# Altium schematic sheet Sheet_1_2022-05-04.schdoc
size 430 x 307 mm
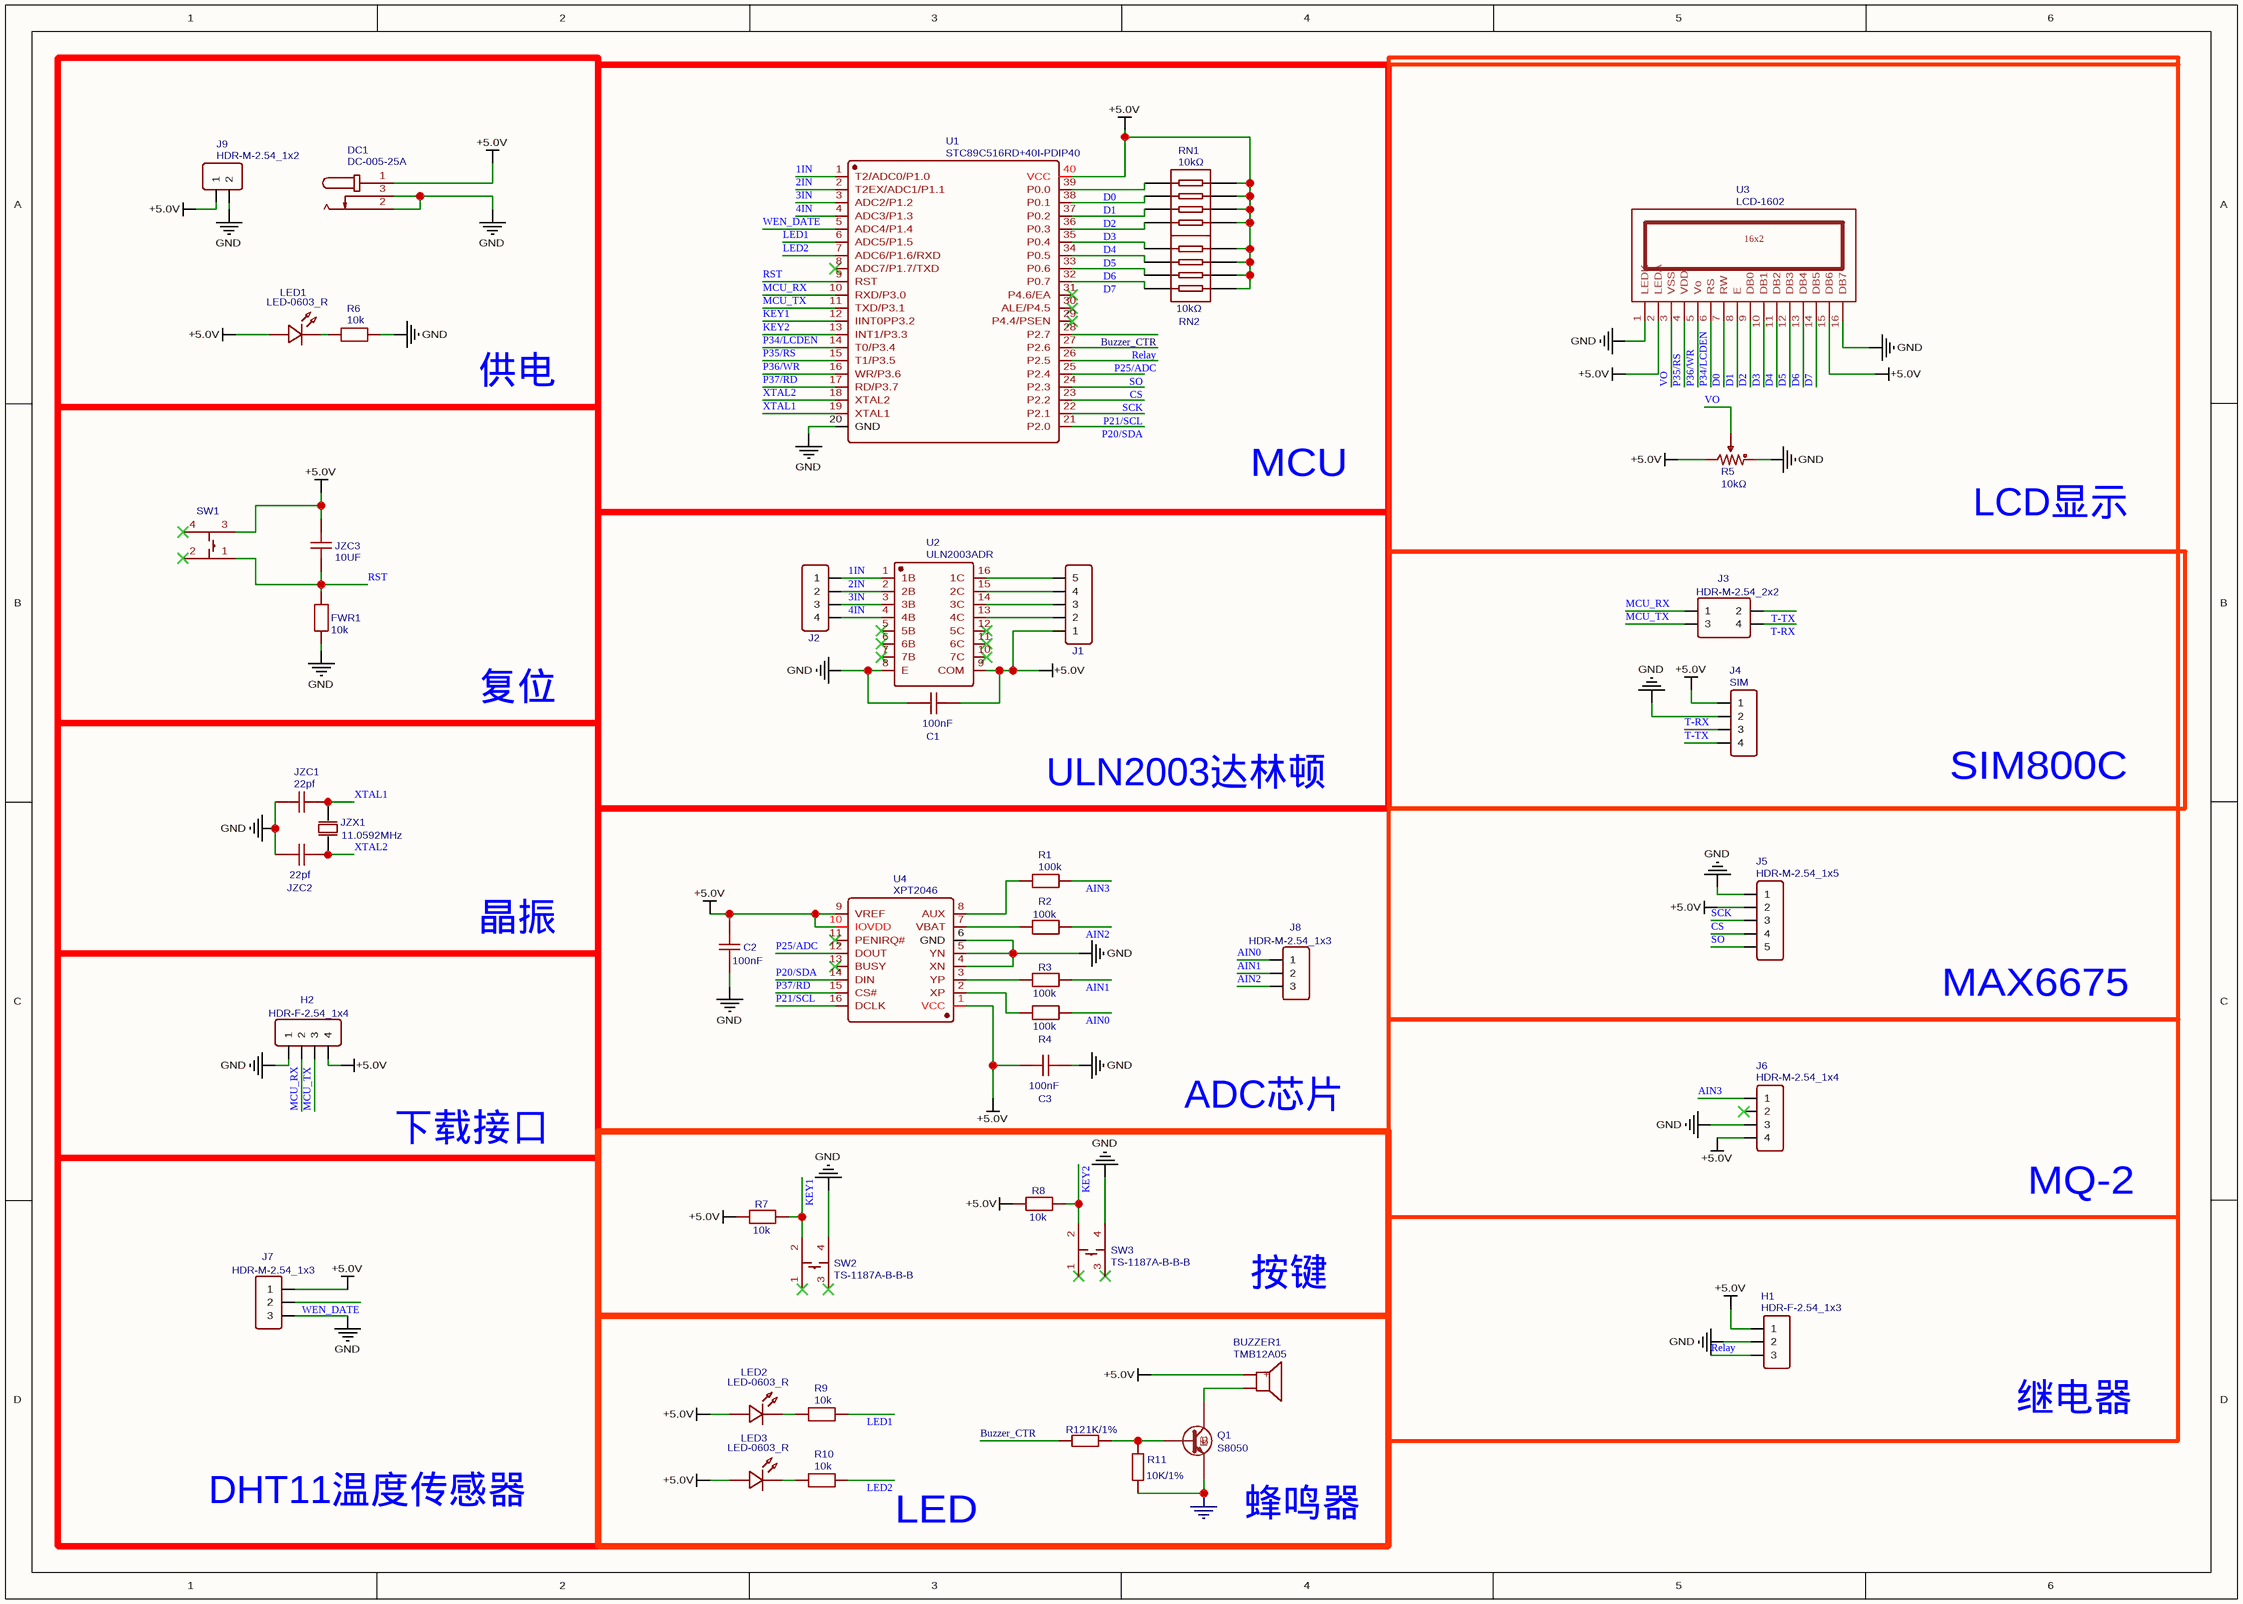
[diagram p0: Sheet_1_2022-05-04.schdoc]

## Parts
BUZZER1  TMB12A05  [BUZ-TH_BD12.0-P7.60-D0.6-FD]
C1  100nF  [C0603]
C2  100nF  [C0603]
C3  100nF  [C0603]
DC1  DC-005-25A  [DC-IN-TH_DC005]
FWR1  10k  [R0603]
H1  HDR-F-2.54_1x3  [HDR-F-2.54_1X3]
H2  HDR-F-2.54_1x4  [HDR-F-2.54_1X4]
J1  HDR-M-2.54_1x5  [HDR-M-2.54_1X5]  (value not drawn)
J2  HDR-M-2.54_1x4  [HDR-M-2.54_1X4]  (value not drawn)
J3  HDR-M-2.54_2x2  [HDR-M-2.54_2X2]
J4  SIM  [HDR-M-2.54_1X4]
J5  HDR-M-2.54_1x5  [HDR-M-2.54_1X5]
J6  HDR-M-2.54_1x4  [HDR-M-2.54_1X4]
J7  HDR-M-2.54_1x3  [HDR-M-2.54_1X3]
J8  HDR-M-2.54_1x3  [HDR-M-2.54_1X3]
J9  HDR-M-2.54_1x2  [HDR-M-2.54_1X2]
JZC1  22pf  [C0603]
JZC2  22pf  [C0603]
JZC3  10UF  [C0603]
JZX1  11.0592MHz  [HC-49US_L11.5-W4.5-P4.88]
LED1  LED-0603_R  [LED0603_RED]
LED2  LED-0603_R  [LED0603_RED]
LED3  LED-0603_R  [LED0603_RED]
Q1  S8050  [SOT23_JX]
R1  100k  [R0603]
R2  100k  [R0603]
R3  100k  [R0603]
R4  100k  [R0603]
R5  10kΩ  [RES-ADJ-TH_3362P]
R6  10k  [R0603]
R7  10k  [R0603]
R8  10k  [R0603]
R9  10k  [R0603]
R10  10k  [R0603]
R11  10K/1%  [0603_R_JX]
R12  1K/1%  [0603_R_JX]
RN1  10kΩ  [RES-ARRAY-SMD_0603-8P-L3.2-W1.6-BL]
RN2  10kΩ  [RES-ARRAY-SMD_0603-8P-L3.2-W1.6-BL]
SW1  TS-1187A-B-B-B  [SW-SMD_4P-L5.1-W5.1-P3.70-LS6.5-TL-2]  (value not drawn)
SW2  TS-1187A-B-B-B  [SW-SMD_4P-L5.1-W5.1-P3.70-LS6.5-TL-2]
SW3  TS-1187A-B-B-B  [SW-SMD_4P-L5.1-W5.1-P3.70-LS6.5-TL-2]
U1  STC89C516RD+40I-PDIP40  [DIP-40_L52.3-W13.9-P2.54-LS15.2-BL]
U2  ULN2003ADR  [SOIC-16_L9.9-W3.9-P1.27-LS6.0-BL]
U3  LCD-1602  [LCD-1602]
U4  XPT2046  [TSSOP-16_L5.0-W4.4-P0.65-LS6.4-BL]

## Blocks framed on the sheet
供电: DC1 J9 LED1 R6
MCU: RN1 RN2 U1
LCD显示: R5 U3
ULN2003达林顿: C1 J1 J2 U2
SIM800C: J3 J4
MAX6675: J5

## Nets
+5.0V: BUZZER1.1(+) C1.2 C2.2 C3.1 DC1.1 H1.1 H2.4 J1.1 J4.1 J5.2 J6.4 J7.1 J9.1 JZC3.2 LED1.1 LED2.1 LED3.1 R5.3 R7.1 R8.1 RN1.5 RN1.6 RN1.7 RN1.8 RN2.5 RN2.6 RN2.7 RN2.8 SW1.3(C) U1.40(VCC) U2.9(COM) U3.2(LEDA) U3.15(DB6) U4.1(VCC) U4.9(VREF) U4.10(IOVDD)
GND: C1.1 C2.1 C3.2 DC1.2 DC1.3 FWR1.1 H1.2 H2.1 J4.2 J5.1 J6.3 J7.3 J9.2 JZC1.1 JZC2.1 Q1.2(E) R5.1 R6.1 R11.1 SW2.4(D) SW3.4(D) U1.20(GND) U2.8(E) U3.1(LEDK) U3.16(DB7) U4.4(XN) U4.5(YN) U4.6(GND)
1IN: J2.1 U1.1(T2/ADC0/P1.0) U2.1(1B)
2IN: J2.2 U1.2(T2EX/ADC1/P1.1) U2.2(2B)
3IN: J2.3 U1.3(ADC2/P1.2) U2.3(3B)
4IN: J2.4 U1.4(ADC3/P1.3) U2.4(4B)
AIN0: J8.1 R4.2
AIN1: J8.2 R3.2
AIN2: J8.3 R2.2
AIN3: J6.1 R1.2
Buzzer_CTR: R12.2 U1.28(P2.7)
CS: J5.4 U1.24(P2.3)
D0: RN1.1 U1.39(P0.0) U3.7(RW)
D1: RN1.2 U1.38(P0.1) U3.8(E)
D2: RN1.3 U1.37(P0.2) U3.9(DB0)
D3: RN1.4 U1.36(P0.3) U3.10(DB1)
D4: RN2.1 U1.35(P0.4) U3.11(DB2)
D5: RN2.2 U1.34(P0.5) U3.12(DB3)
D6: RN2.3 U1.33(P0.6) U3.13(DB4)
D7: RN2.4 U1.32(P0.7) U3.14(DB5)
KEY1: R7.2 SW2.2(B) U1.12(IINT0PP3.2)
KEY2: R8.2 SW3.2(B) U1.13(INT1/P3.3)
LED1: R9.1 U1.6(ADC5/P1.5)
LED2: R10.1 U1.7(ADC6/P1.6/RXD)
MCU_RX: H2.2 J3.1 U1.10(RXD/P3.0)
MCU_TX: H2.3 J3.3 U1.11(TXD/P3.1)
P20/SDA: U1.21(P2.0) U4.14(DIN)
P21/SCL: U1.22(P2.1) U4.16(DCLK)
P25/ADC: U1.26(P2.5) U4.12(DOUT)
P34/LCDEN: U1.14(T0/P3.4) U3.6(RS)
P35/RS: U1.15(T1/P3.5) U3.4(VDD)
P36/WR: U1.16(WR/P3.6) U3.5(Vo)
P37/RD: U1.17(RD/P3.7) U4.15(CS#)
Relay: H1.3 U1.27(P2.6)
RST: FWR1.2 JZC3.1 SW1.1(A) U1.9(RST)
SCK: J5.3 U1.23(P2.2)
SO: J5.5 U1.25(P2.4)
T-RX: J3.4 J4.3
T-TX: J3.2 J4.4
VO: R5.2 U3.3(VSS)
WEN_DATE: J7.2 U1.5(ADC4/P1.4)
XTAL1: JZC1.2 JZX1.1(OSC1) U1.19(XTAL1)
XTAL2: JZC2.2 JZX1.2(OSC2) U1.18(XTAL2)
NetBUZZER1_2: BUZZER1.2 Q1.3(C)
NetJ1_2: J1.2 U2.13(4C)
NetJ1_3: J1.3 U2.14(3C)
NetJ1_4: J1.4 U2.15(2C)
NetJ1_5: J1.5 U2.16(1C)
NetLED1_2: LED1.2 R6.2
NetLED2_2: LED2.2 R9.2
NetLED3_2: LED3.2 R10.2
NetQ1_1: Q1.1(B) R11.2 R12.1
NetR1_1: R1.1 U4.8(AUX)
NetR2_1: R2.1 U4.7(VBAT)
NetR3_1: R3.1 U4.3(YP)
NetR4_1: R4.1 U4.2(XP)

Not connected (* = marked no-connect by the designer): J6 2*; SW1 2(B)* 4(D)*; SW2 1(A)* 3(C)*; SW3 1(A)* 3(C)*; U1 8(ADC7/P1.7/TXD)* 29(P4.4/PSEN)* 30(ALE/P4.5)* 31(P4.6/EA)*; U2 5(5B)* 6(6B)* 7(7B)* 10(7C)* 11(6C)* 12(5C)*; U4 11(PENIRQ#)* 13(BUSY)*

## Notes on the sheet
- 复位
- 晶振
- 下载接口
- ADC芯片
- MQ-2
- 按键
- 继电器
- DHT11温度传感器
- LED
- (near Q1) 蜂鸣器
- (in symbol LCD-1602) 16x2

## Library data of the parts
BUZZER1 = TMB12A05: BOM_Manufacturer: HNDZ; Frequency: 2300Hz; BOM_Supplier: LCSC; BOM_Manufacturer Part: TMB12A05; BOM_Supplier Part: C96093; BOM_JLCPCB Part Class: Extended Part; spicePre: B; spiceSymbolName: TMB12A05
C1-C3 = 100nF: nameAlias: Value(F); Contributor: LCEDA_Lib; spicePre: C; spiceSymbolName: C_0603_US
DC1 = DC-005-25A: BOM_Manufacturer: HRO; Contributor: LCSC; BOM_Supplier: LCSC; BOM_Manufacturer Part: DC-005-25A; BOM_Supplier Part: C136715; BOM_JLCPCB Part Class: Extended Part; spicePre: D; spiceSymbolName: DC-005-25A
FWR1 R6-R10 = 10k: nameAlias: Value(Ω); Contributor: LCEDA_Lib; spicePre: R; spiceSymbolName: R_0603_EU
H1 = HDR-F-2.54_1x3: Contributor: LCEDA_Lib; BOM_Supplier Part: C146690; BOM_Supplier: LCSC; spicePre: H; spiceSymbolName: HDR-F-2.54_1x3
H2 = HDR-F-2.54_1x4: Contributor: LCEDA_Lib; BOM_Supplier Part: C225501; BOM_Supplier: LCSC; spicePre: H; spiceSymbolName: HDR-F-2.54_1x4
J1 J5 = HDR-M-2.54_1x5: Contributor: LCEDA_Lib; BOM_Supplier Part: C358687; BOM_Supplier: LCSC; spicePre: J; spiceSymbolName: HDR-M-2.54_1x5
J2 J6 = HDR-M-2.54_1x4: Contributor: LCEDA_Lib; BOM_Supplier Part: C124378; BOM_Supplier: LCSC; spicePre: J; spiceSymbolName: HDR-M-2.54_1x4
J3 = HDR-M-2.54_2x2: Contributor: LCEDA_Lib; BOM_Supplier Part: C66690; BOM_Supplier: LCSC; spicePre: J; spiceSymbolName: HDR-M-2.54_2x2
J4 = SIM: Contributor: LCEDA_Lib; BOM_Supplier Part: C124378; BOM_Supplier: LCSC; spicePre: J; spiceSymbolName: HDR-M-2.54_1x4
J7 J8 = HDR-M-2.54_1x3: Contributor: LCEDA_Lib; BOM_Supplier Part: C180248; BOM_Supplier: LCSC; spicePre: J; spiceSymbolName: HDR-M-2.54_1x3
J9 = HDR-M-2.54_1x2: Contributor: LCEDA_Lib; BOM_Supplier Part: C124375; BOM_Supplier: LCSC; spicePre: J; spiceSymbolName: HDR-M-2.54_1x2
JZC1 JZC2 = 22pf: nameAlias: Value(F); Contributor: LCEDA_Lib; spicePre: C; spiceSymbolName: C_0603_US
JZC3 = 10UF: nameAlias: Value(F); Contributor: LCEDA_Lib; spicePre: C; spiceSymbolName: C_0603_US
JZX1 = 11.0592MHz: BOM_Manufacturer: YXC; BOM_Manufacturer Part: X49SD1431818MSD2SC; nameAlias: Frequency; BOM_Supplier: LCSC; BOM_Supplier Part: C2206; spicePre: X; spiceSymbolName: X49SD1431818MSD2SC
LED1-LED3 = LED-0603_R: BOM_Manufacturer: EVERLIGHT(台湾亿光); BOM_Manufacturer Part: 19-217/R6C-AL1M2VY/3T; Contributor: LCEDA_01; BOM_Supplier Part: C72044; BOM_Supplier: LCSC; spicePre: L; spiceSymbolName: LED-0603_R
Q1 = S8050: catid: 20; spicePre: Q; BOM_Supplier: LCSC
R1-R4 = 100k: nameAlias: Value(Ω); Contributor: LCEDA_Lib; spicePre: R; spiceSymbolName: R_0603_EU
R5 = 10kΩ: BOM_Manufacturer: Chengdu Guosheng Tech; BOM_Manufacturer Part: 3362P-1-103; Resistance(Ohms): 10K; nameAlias: Resistance; Contributor: LCSC; BOM_Supplier: LCSC; BOM_Supplier Part: C118956; Resistance (Ohms): 10K; BOM_JLCPCB Part Class: Extended Part; spicePre: R; spiceSymbolName: 3362P-1-103_C118956
R11 = 10K/1%: nameAlias: Value(Ω); spicePre: R; spiceSymbolName: Resistor; BOM_Supplier: LCSC
R12 = 1K/1%: nameAlias: Value(Ω); spicePre: R; spiceSymbolName: Resistor; BOM_Supplier: LCSC
RN1 RN2 = 10kΩ: BOM_Manufacturer: UniOhm; BOM_Manufacturer Part: 4D03WGJ0103T5E; nameAlias: Resistance; Resistance (Ohms): 10K; BOM_Supplier: LCSC; BOM_Supplier Part: C29718; BOM_JLCPCB Part Class: Basic Part; spicePre: R; spiceSymbolName: 4D03WGJ0103T5E
SW1-SW3 = TS-1187A-B-B-B: BOM_Manufacturer: XKB Enterprise; Contributor: LCSC; BOM_Supplier: LCSC; BOM_Supplier Part: C528026; BOM_Manufacturer Part: TS-1187A-B-B-B; BOM_JLCPCB Part Class: Extended Part; spicePre: S; spiceSymbolName: TS-1187A-B-B-B
U1 = STC89C516RD+40I-PDIP40: BOM_Manufacturer: STC; BOM_Supplier: LCSC; BOM_Manufacturer Part: STC89C516RD+40I-PDIP40; BOM_Supplier Part: C52225; BOM_JLCPCB Part Class: Extended Part; spicePre: U; spiceSymbolName: STC89C516RD+40I-PDIP40
U2 = ULN2003ADR: BOM_Manufacturer: TI; spicePre: X; BOM_Supplier: LCSC; BOM_Manufacturer Part: ULN2003ADR; BOM_Supplier Part: C7512; BOM_JLCPCB Part Class: Basic Part; spiceSymbolName: ULN2003ADR
U3 = LCD-1602: Contributor: andrewivkh; BOM_Manufacturer Part: LCD-1602; spicePre: U; spiceSymbolName: LCD-1602
U4 = XPT2046: BOM_Manufacturer: XPT; BOM_Supplier: LCSC; BOM_Manufacturer Part: XPT2046; BOM_Supplier Part: C19076; BOM_JLCPCB Part Class: Extended Part; spicePre: U; spiceSymbolName: XPT2046